# Altium schematic sheet Motor.SchDoc: Motor + USB
size A4; Engineer: CT; SheetNumber: 5; SheetTotal: 5
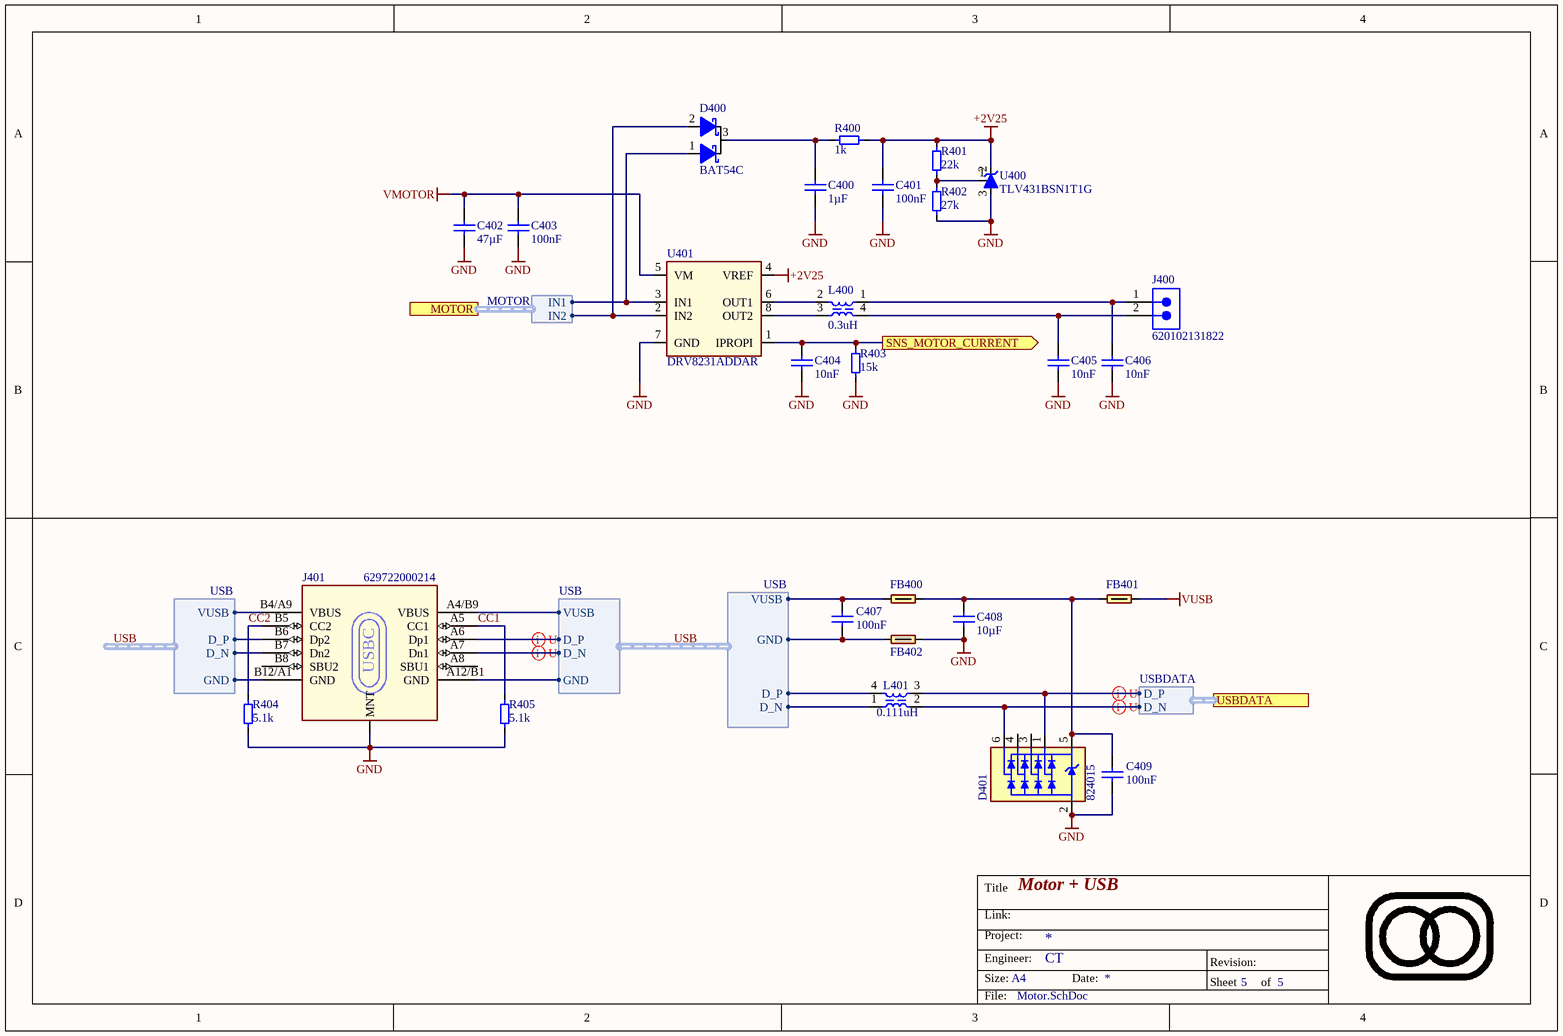
[diagram p0: Motor.SchDoc]

## Parts
C400  value 1µF  [0603-C-N]  (hidden comment: Capacitor 1µF +/-10% 16V X7R 0603)
C401  value 100nF  [0603-C-N]  (hidden comment: Capacitor 100nF +/-10% 10V X7R 0603)
C402  value 47µF  [WCAP-CSGP_1210_L3.2W2.5H2.5]  (hidden comment: Capacitor 47µF +/-20% 16V X5R 1210)
C403  value 100nF  [0603-C-N]  (hidden comment: Capacitor 100nF +/-10% 10V X7R 0603)
C404  value 10nF  [0603-C-N]  (hidden comment: Capacitor 10nF +/-10% 16V X7R 0603)
C405  value 10nF  [0603-C-N]  (hidden comment: Capacitor 10nF +/-10% 16V X7R 0603)
C406  value 10nF  [0603-C-N]  (hidden comment: Capacitor 10nF +/-10% 16V X7R 0603)
C407  value 100nF  [0603-C-N]  (hidden comment: Capacitor 100nF +/-10% 10V X7R 0603)
C408  value 10µF  [1206-C-N]  (hidden comment: Capacitor 10µF +/-10% 16V X7R 1206)
C409  value 100nF  [0603-C-N]  (hidden comment: Capacitor 100nF +/-10% 10V X7R 0603)
D400  BAT54C  [SOT-23-3-N]
D401  824015  [SOT-23-6]
FB400  742792651  [0603-FB-N]  (value not drawn)
FB401  742792651  [0603-FB-N]  (value not drawn)
FB402  742792651  [0603-FB-N]  (value not drawn)
J400  620102131822  [620102131822]
J401  629722000214  [629722000214]
L400  Inductance: 0.3uH  [WE-CNSW_1812]  (hidden comment: 744235900)
L401  Inductance: 0.111uH  [WE-CNSW_1206]  (hidden comment: 744232090)
R400  value 1k  [0603-R-N]  (hidden comment: Resistor 1k +/-1% 75V 0603)
R401  value 22k  [0603-R-N]  (hidden comment: Resistor 22k +/-1% 0.1W 0603)
R402  value 27k  [0603-R-N]  (hidden comment: Resistor 27K +/-1% 0.1W 0603)
R403  value 15k  [0603-R-N]  (hidden comment: Resistor 15k +/- 1% 0.1W 0603)
R404  value 5.1k  [0603-R-N]  (hidden comment: Resistor 5.1k +/-1% 75V 0603)
R405  value 5.1k  [0603-R-N]  (hidden comment: Resistor 5.1k +/-1% 75V 0603)
U400  TLV431BSN1T1G  [SOT-23-3-N]
U401  DRV8231ADDAR  [SOIC8_N_EP]

## Ports
MOTOR (harness MOTOR), SNS_MOTOR_CURRENT (out), USBDATA (harness USBDATA)

## Harnesses
MOTOR: IN1, IN2
USB: VUSB, D_P, D_N, GND
USBDATA: D_P, D_N

## Nets
+2V25: C401.1 R400.1 R401.2 U400.2(C) U401.4(VREF)
GND: C400.2 C401.2 C402.1 C403.2 C404.1 C405.1 C406.1 C408.1 C409.1 D401.2 FB402.2 J401.MNT R402.1 R403.1 R404.1 R405.1 U400.3(A) U401.7(GND)
VMOTOR: C402.2 C403.1 U401.5(VM)
VUSB: FB401.2
CC1: J401.A5(CC1) R405.2
CC2: J401.B5(CC2) R404.2
SNS_MOTOR_CURRENT: C404.2 R403.2 U401.1(IPROPI) ; port SNS_MOTOR_CURRENT
USB.D_N: J401.A7(Dn1) J401.B7(Dn2) L401.1 ; harness USB.D_N
USB.D_P: J401.A6(Dp1) J401.B6(Dp2) L401.4 ; harness USB.D_P
USB.GND: C407.1 FB402.1 J401.A12/B1(GND) J401.B12/A1(GND) ; harness USB.GND
USB.VUSB: C407.2 FB400.1 J401.A4/B9(VBUS) J401.B4/A9(VBUS) ; harness USB.VUSB
NetC400_1: C400.1 D400.3(A) R400.2
NetC405_2: C405.2 J400.2 L400.4
NetC406_2: C406.2 J400.1 L400.1
NetC408_2: C408.2 C409.2 D401.5 FB400.2 FB401.1
NetD400_1: D400.1(C1) U401.3(IN1) ; port MOTOR.IN1
NetD400_2: D400.2(C2) U401.2(IN2) ; port MOTOR.IN2
NetD401_1: D401.1 L401.3 ; port USBDATA.D_P
NetD401_6: D401.6 L401.2 ; port USBDATA.D_N
NetL400_2: L400.2 U401.6(OUT1)
NetL400_3: L400.3 U401.8(OUT2)
NetR401_1: R401.1 R402.2 U400.1(rEF)

Not connected (* = marked no-connect by the designer): D401 3 4; J401 A8(SBU1) B8(SBU2)

## Layout directives
differential pair: NetD401_1, NetD401_6, USB.D_N, USB.D_P

## Notes on the sheet
- Title
- Link:
- Size:
- Project:
- Engineer:
- A4
- Date:
- Revision:
- Sheet
- of
- File:
- (in symbol CMP-088-000027-3) USBC

## Library data of the parts
C400 = CMP-001-00004-18: Capacitor MLCC, General Purpose, size 0603, X7R, 1µF, +/-10%, 16V; Tolerance: 10%; Usage: General Purpose; Mounting Technology: SMT; Width: 0.8mm; Voltage Rating: 16V; RoHS Compliant: True; Capacitor Type: MLCC; Case/Package: 0603; Min Operating Temperature: -55°C; Dielectric: X7R; Pins: 2; Max Operating Temperature: 125°C; Length: 1.6mm; Height: 0.8mm; JLCPCB Part #: C15849
C401 C403 C407 C409 = CMP-072-000541-10: WCAP-CSGP Multilayer Ceramic Chip Capacitor, General Purpose, size 0603, X7R, 100nF, 10VDC; Capacitor Type: MLCC; Tolerance: 10%; Dissipation Factor: 5%; Technical Reference: X7R0603104K010DFCT10000; Insulation Resistance: 5GO; Length: 1.6mm; Dielectric: X7R; Height: 0.8mm; Pins: 2; Min Operating Temperature: -55°C; Usage: General Purpose; Mounting Technology: SMT; Case/Package: 0603; Width: 0.8mm; Max Operating Temperature: 125°C; Voltage Rating: 10V; Design Item ID: 885012206020; ComponentLink1URL: https://www.we-online.com/redexpert/article/885012206020?ad; ComponentLink2URL: https://www.we-online.com/redexpert/spec/885012206020?ad; Packaging: Tape and Reel; ComponentLink1Description: Website Link; Match Code: WCAP-CSGP; ComponentLink2Description: Datasheet Link; Source: WCAP-CSGP.SchLib
C402 = CMP-072-000445-11: WCAP-CSGP Multilayer Ceramic Chip Capacitor, General Purpose, size 1210, X5R, 47µF, 16VDC; Capacitor Type: MLCC; Technical Reference: X5R1210476M016DFCT10000; Tolerance: 20%; Insulation Resistance: 0.002GO; Dissipation Factor: 10%; Height: 2.5mm; Width: 2.5mm; Mounting Technology: SMT; Source: WCAP-CSGP.SchLib; Length: 3.2mm; Voltage Rating: 16V; Packaging: Tape and Reel; ComponentLink2URL: https://www.we-online.com/redexpert/spec/885012109011?ad; Design Item ID: 885012109011; Case/Package: 1210; Min Operating Temperature: -55°C; Usage: General Purpose; Match Code: WCAP-CSGP; ComponentLink1URL: https://www.we-online.com/redexpert/article/885012109011?ad; Dielectric: X5R; Pins: 2; Max Operating Temperature: 85°C; ComponentLink2Description: Datasheet Link; ComponentLink1Description: Website Link
C404-C406 = CMP-072-000561-10: WCAP-CSGP Multilayer Ceramic Chip Capacitor, General Purpose, size 0603, X7R, 10nF, 16VDC; Capacitor Type: MLCC; Tolerance: 10%; Technical Reference: X7R0603103K016DFCT10000; Insulation Resistance: 10GO; Dissipation Factor: 3.5%; ComponentLink2Description: Datasheet Link; Height: 0.8mm; Mounting Technology: SMT; Source: WCAP-CSGP.SchLib; ComponentLink2URL: https://www.we-online.com/redexpert/spec/885012206040?ad; Match Code: WCAP-CSGP; ComponentLink1Description: Website Link; ComponentLink1URL: https://www.we-online.com/redexpert/article/885012206040?ad; Packaging: Tape and Reel; Design Item ID: 885012206040; Case/Package: 0603; Width: 0.8mm; Length: 1.6mm; Max Operating Temperature: 125°C; Pins: 2; Usage: General Purpose; Dielectric: X7R; Min Operating Temperature: -55°C; Voltage Rating: 16V
C408 = CMP-072-000800-12: WCAP-CSGP Multilayer Ceramic Chip Capacitor, General Purpose, size 1206, X7R, 10µF, 16VDC; Capacitor Type: MLCC; Tolerance: 10%; Technical Reference: X7R1206106K016DFCT10000; Insulation Resistance: 0.01GO; Voltage Rating: 16V; Height: 1.6mm; Pins: 2; Usage: General Purpose; Min Operating Temperature: -55°C; Max Operating Temperature: 125°C; Width: 1.6mm; Dielectric: X7R; Case/Package: 1206; Mounting Technology: SMT; Length: 3.2mm; ComponentLink1URL: https://www.we-online.com/redexpert/article/885012208041?ad; ComponentLink2URL: https://www.we-online.com/redexpert/spec/885012208041?ad; ComponentLink1Description: Website Link; Match Code: WCAP-CSGP; Packaging: Tape and Reel; JLCPCB Part #: C13585; Dissipation Factor: 10%; Design Item ID: 885012208041; Source: WCAP-CSGP.SchLib; ComponentLink2Description: Datasheet Link
D400 = CMP-004-00045-4: Rectifier Diode Small Signal Schottky 30V 0.2A 5ns Automotive 3-Pin SOT-23 T/R; Value: 10pF; Forward Current: 200mA; Current Rating: 200A; Element Configuration: Common Cathode; Max Forward Surge Current (Ifsm): 600mA; Forward Voltage: 800mV; Case/Package: SOT-23-3; Reach SVHC Compliant: Yes; Min Operating Temperature: -55°C; RoHS Compliant: Yes; Termination: SMD/SMT; Pins: 3; Packaging: Tape and Reel; Reverse Recovery Time: 5ns; Lead Free: Lead Free; Voltage: 30V; Max Repetitive Reverse Voltage (Vrrm): 30V; Max Operating Temperature: 150°C; Max Reverse Voltage (DC): 30V
D401 = CMP-034-000015-5: WE-TVS TVS Diode - High Speed Series, SOT23-6L, 4+1Channel, 5Vdc; Manufacturer: Wurth Elektronik; Reverse Breakdown Voltage min.: 6.1V; Channel Input Capacitance: 2pF; Reverse Channel Leakage Current: 2uA; Reverse Peak Pulse Current: 12A; Channel: 4+1; DC Operating Voltage: 5V; Design Item ID: 824015; ComponentLink2URL: https://www.we-online.com/catalog/datasheet/824015.pdf; Operating Temperature: -40 to +125degC; Size: SOT23-6L; Source: WE-TVS.SchLib; ComponentLink1Description: Manufacturer; ComponentLink1URL: http://www.we-online.de; Published Date: April 2020; Packaging: Tape and Reel; Manufacturer Part Number: 824015; Mounting Technology: SMT; ComponentLink2Description: Datasheet; Pin Count: 6; Component Type: Standard
FB400-FB402 = CMP-066-000122-5: WE-CBF SMT EMI Suppression Ferrite Bead, size 0603, 600O, 1A; Manufacturer: Wurth Elektronik; Impedance Max: 800O; Impedance Max Test Condition: 200MHz; Type: High Current; Case/Size Code: 0603; DC Resistance Max: 0.2O; ComponentLink1URL: https://www.we-online.com/redexpert/article/742792651?ad; ComponentLink2Description: Datasheet Link; Operating Temperature Max: 125°C; Manufacturer Part Number: 742792651; Category: Ferrites for PCB Assembly; Pin Count: 2; Design Item ID: 742792651; Match Code: WE-CBF; Operating Temperature Min: -55°C; Length: 1.6mm; Width: 0.8mm; Component Type: Standard; Height: 0.8mm; ComponentLink1Description: Website Link; ComponentLink2URL: https://www.we-online.com/redexpert/spec/742792651?ad; Impedance @100MHz: 600O; Mount: Surface Mount; Rated Current: 1A; Source: WE-CBF.SchLib; Packaging: Tape and Reel
J400 = CMP-047-000040-7: WR-WTB SMT Male Horizontal Shrouded Header, pitch 2mm, 2p; Rated Current: 2A; Pin Number: 2; Working Voltage: 100VAC; Withstanding Voltage: 800VAC; Contact Resistance: 20mOhm; Publisher: Wurth Elektronik; ComponentLink1URL: http://www.we-online.de; Operating Temperature: -25 to +85degC; Pitch: 2mm; Published Date: January 2020; Pin Count: 2; ComponentLink2Description: Datasheet; ComponentLink2URL: https://www.we-online.com/catalog/datasheet/620102131822.pdf; Gender: Male; Part Number: 620102131822; Component Type: Standard; Packaging: Tape and Reel; Type: Horizontal; ComponentLink1Description: Manufacturer; Source: WR-WTB_2.00mm.SchLib; Mounting Technology: SMT; Design Item ID: 620102131822
J401 = CMP-088-000027-3: WR-USB 2.0 Type C, Receptacle, Horizontal, SMT; pin to pad: MNT>S1+S2+S3+S4; Manufacturer: Wurth Elektronik; Number of Ports: 1; Rated Current: 5A; Interface Type: Type C; Working Voltage: 20VAC; Operating Temperature Max: 85°C; Design Item ID: 629722000214; Pin Count: 13; ComponentLink2Description: Datasheet Link; Orientation: Horizontal; Operating Temperature Min: -40°C; Mount: Surface Mount; Match Code: WR-USB; Number of Pins: 16; Source: WR-USB.SchLib; Component Type: Standard; ComponentLink2URL: https://www.we-online.com/redexpert/spec/629722000214?ad; ComponentLink1Description: Website Link; Category: Input/Output Connectors; Packaging: Tape and Reel; Gender: Receptacle; Application: USB 2.0; Manufacturer Part Number: 629722000214; ComponentLink1URL: https://www.we-online.com/redexpert/article/629722000214?ad
L400 = CMP-061-000026-4: WE-CNSW SMT Common Mode Line Filter, size 1812, 90Ohm, 0.3uH, 60V; Manufacturer: Wurth Elektronik; Insulation Test Voltage: 125VAC; Rated Current: 2A; Case/Size Code: 1812; Winding Style: bifiliar; DC Resistance Max: 0.05Ohm; Source: WE-CNSW.SchLib; Width: 3.2mm; Impedance @100MHz: 90Ohm; Rated Voltage: 60V; Category: Common Mode Chokes; ComponentLink1Description: Manufacturer Link; Length: 4.5mm; ComponentLink2URL: https://www.we-online.com/redexpert/spec/744235900?ad; Design Item ID: 744235900; ComponentLink2Description: Datasheet; Manufacturer Part Number: 744235900; Component Type: Standard; Operating Temperature Min: -40°C; Height: 2.8mm; ComponentLink1URL: https://www.we-online.com/redexpert/article/744235900?ad; Match Code: WE-CNSW; Packaging: Tape and Reel; Operating Temperature Max: 125°C; Pin Count: 4; Mount: Surface Mount
L401 = CMP-061-000012-3: WE-CNSW SMT Common Mode Line Filter, size 1206, 90Ohm, 0.111uH, 50V; Manufacturer: Wurth Elektronik; Rated Current: 0.37A; DC Resistance Max: 0.3Ohm; Winding Style: bifiliar; Insulation Test Voltage: 125VAC; Case/Size Code: 1206; ComponentLink2Description: Datasheet; Operating Temperature Min: -40°C; Width: 1.6mm; Length: 3.2mm; Height: 1.8mm; Rated Voltage: 50V; ComponentLink1Description: Manufacturer Link; Pin Count: 4; Design Item ID: 744232090; ComponentLink2URL: https://www.we-online.com/redexpert/spec/744232090?ad; Operating Temperature Max: 125°C; Packaging: Tape and Reel; Impedance @100MHz: 90Ohm; ComponentLink1URL: https://www.we-online.com/redexpert/article/744232090?ad; Source: WE-CNSW.SchLib; Manufacturer Part Number: 744232090; Component Type: Standard; Mount: Surface Mount; Match Code: WE-CNSW; Category: Common Mode Chokes
R400 = CMP-009-00014-19: Chip Resistor, Thick Film, General Purpose, 0603, 100mW, 75V, 1 kOhm, +/-1%; Tolerance: 1%; Elements: 1; Usage: General Purpose; JLCPCB Part #: C21190; Max Operating Temperature: 155°C; Power Rating: 100mW; Min Operating Temperature: -55°C; Mounting Technology: SMT; Resistor Type: Thick Film; Voltage Rating: 75V; Case/Package: 0603; RoHS Compliant: True; Pins: 2
R401 = CMP-009-00245-8: Chip Resistor, Thick Film, General Purpose, 0603, 100mW, 75V, 22 Ohm, +/-1%; Elements: 1; Tolerance: 1%; Usage: General Purpose; RoHS Compliant: Yes; Mounting Technology: SMT; Resistor Type: Thick Film; Min Operating Temperature: -55°C; Voltage Rating: 75V; Max Operating Temperature: 155°C; Power Rating: 100mW; Pins: 2; Case/Package: 0603
R402 = CMP-009-00275-5: Res Thick Film 0603 27K Ohm 1% 0.1W(1/10W) ±100ppm/C Pad SMD Automotive T/R; Usage: General Purpose; Max Power Dissipation: 100mW; Case/Package: 0603; Tolerance: 1%
R403 = CMP-009-00284-4: Res Thick Film 0603 15K Ohm 1% 1/10W ±100ppm/°C Molded SMD Paper T/R; Max Power Dissipation: 100mW; Usage: General Purpose; Voltage Rating: 50V; RoHS Compliant: Yes; Features: Moisture Resistant; Pins: 2; Power Rating: 100mW; Packaging: Tape and Reel; Case Code (Imperial): 0603; Max Operating Temperature: 155°C; Number of Terminations: 2; Resistor Type: Thick Film; Military Standard: Not; Resistance Tolerance: 1%; Height: 0.022inch; Series: RC; Termination: SMD/SMT; Length: 0.063inch; Lead Free: Lead Free; Package Quantity: 1; Case/Package: 0603; Min Operating Temperature: -55°C; Construction: Rectangular; Case Code (Metric): 1608; Width: 0.031inch; Temperature Coefficient: 100ppm/°C; Tolerance: 1%; Depth: 0.8mm; Voltage Rating (DC): 50V
R404 R405 = CMP-009-00192-11: Chip Resistor, Thick Film, General Purpose, 0603, 100mW, 75V, 5.1 kOhm, +/-1%; Temperature Coefficient: 100ppm/°C; Tolerance: 1%; Elements: 1; Case/Package: 0603; Mounting Technology: SMT; Packaging: Cut Tape; Power Rating: 100mW; Min Operating Temperature: -55°C; Pins: 2; Resistor Type: Thick Film; Voltage Rating: 75V; Usage: General Purpose; REACH SVHC: No SVHC; Max Operating Temperature: 155°C
U400 = CMP-019-00078-4: Adjustable Shunt Voltage Reference 1.24 - 16V; +/-0.5%; 3-Pin SOT-23; Tolerance: 0.5%; Min Output Voltage: 1.24V; Reference Type: Shunt,Adjustable; Cathode Current: 80uA; Max Input Voltage: 18V; Output Current: 20mA; Number of Channels: 1; Lead Free: Lead Free; Output Type: Adjustable; Length: 3.04mm; Number of Pins: 3; RoHS Compliant: Yes; Packaging: Tape and Reel; Height: 1.01mm; Mount: Surface Mount; Reach SVHC Compliant: Yes; Package Quantity: 3000; Accuracy: 0.5%; Max Operating Temperature: 85°C; Output Voltage: 16V; Max Output Voltage: 16V; Series: -; Reference Voltage: 1.24V; Sink current: 20mA; Case/Package: SOT-23-3; Output voltage (max): 16V; Min Operating Temperature: -40°C; Radiation Hardening: No; Width: 1.4mm; Halogen Free: Halogen Free; Max Output Current: 20mA
U401 = CMP-001-0029-2: 35-V, 3.7-A H-bridge motor driver with integrated current regulation & current-sense feedback 8-SO PowerPAD -40 to 150; pin to pad: 7>7+9